# Altium schematic sheet Sheet1.SchDoc: kkkk
size A4
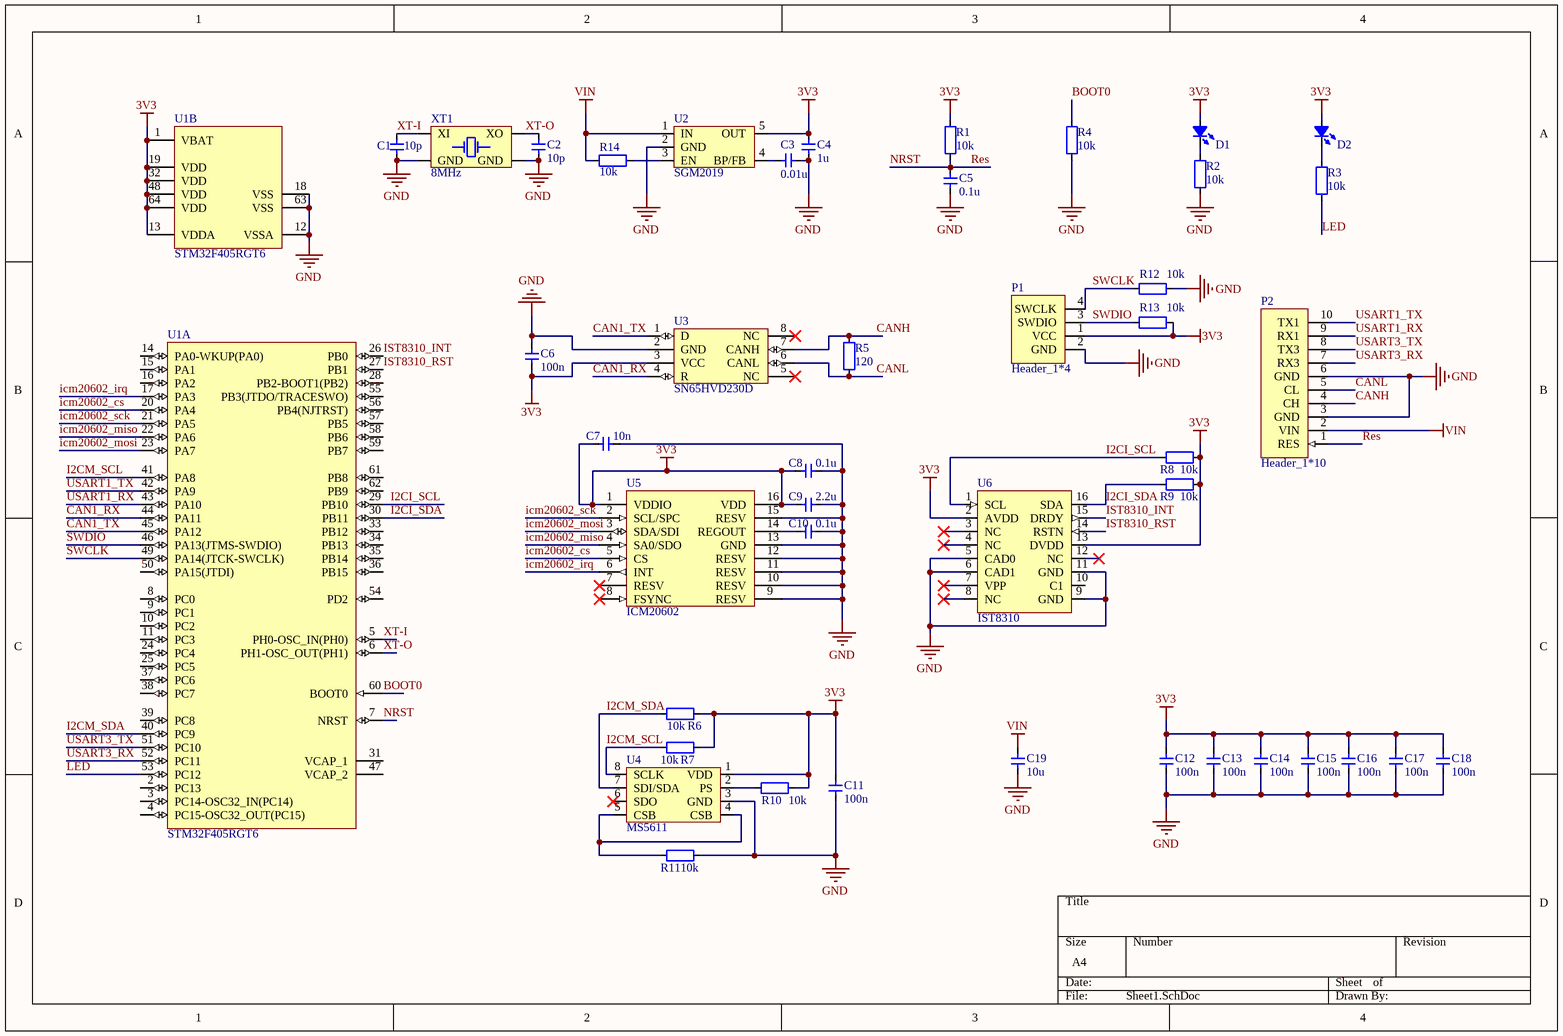
[diagram p0: Sheet1.SchDoc]

## Parts
C1  value 10p  [CAP_0603]  (hidden comment: Cap_0603)
C2  value 10p  [CAP_0603]  (hidden comment: Cap_0603)
C3  value 0.01u  [CAP_0603]  (hidden comment: Cap_0603)
C4  value 1u  [CAP_0603]  (hidden comment: Cap_0603)
C5  value 0.1u  [CAP_0603]  (hidden comment: Cap_0603)
C6  value 100n  [CAP_0603]  (hidden comment: Cap_0603)
C7  value 10n  [CAP_0603]  (hidden comment: Cap_0603)
C8  value 0.1u  [CAP_0603]  (hidden comment: Cap_0603)
C9  value 2.2u  [CAP_0603]  (hidden comment: Cap_0603)
C10  value 0.1u  [CAP_0603]  (hidden comment: Cap_0603)
C11  value 100n  [CAP_0603]  (hidden comment: Cap_0603)
C12  value 100n  [CAP_0603]  (hidden comment: Cap_0603)
C13  value 100n  [CAP_0603]  (hidden comment: Cap_0603)
C14  value 100n  [CAP_0603]  (hidden comment: Cap_0603)
C15  value 100n  [CAP_0603]  (hidden comment: Cap_0603)
C16  value 100n  [CAP_0603]  (hidden comment: Cap_0603)
C17  value 100n  [CAP_0603]  (hidden comment: Cap_0603)
C18  value 100n  [CAP_0603]  (hidden comment: Cap_0603)
C19  value 10u  [CAP_0805]  (hidden comment: Cap_0805)
D1  LED_0603  [LED_0603]  (value not drawn)
D2  LED_0603  [LED_0603]  (value not drawn)
P1  Header_1*4  [HDR1*4]
P2  Header_1*10  [HDR1*10]
R1  value 10k  [RES_0603]  (hidden comment: Res_0603)
R2  value 10k  [RES_0603]  (hidden comment: Res_0603)
R3  value 10k  [RES_0603]  (hidden comment: Res_0603)
R4  value 10k  [RES_0603]  (hidden comment: Res_0603)
R5  value 120  [RES_0603]  (hidden comment: Res_0603)
R6  value 10k  [RES_0603]  (hidden comment: Res_0603)
R7  value 10k  [RES_0603]  (hidden comment: Res_0603)
R8  value 10k  [RES_0603]  (hidden comment: Res_0603)
R9  value 10k  [RES_0603]  (hidden comment: Res_0603)
R10  value 10k  [RES_0603]  (hidden comment: Res_0603)
R11  value 10k  [RES_0603]  (hidden comment: Res_0603)
R12  value 10k  [RES_0603]  (hidden comment: Res_0603)
R13  value 10k  [RES_0603]  (hidden comment: Res_0603)
R14  value 10k  [RES_0603]  (hidden comment: Res_0603)
U1  STM32F405RGT6  [STM-LQFP64_N]  (parts A,B of 2)
U2  SGM2019  [SGM2019]
U3  SN65HVD230D  [SN65HVD230]
U4  MS5611  [MS5611]
U5  ICM20602  [ICM20602]
U6  IST8310  [IST8310]
XT1  value 8MHz  [XT_2520_4]  (hidden comment: XTAL_2520_4P)

## Nets
3V3: C4.2 C6.1 C7.2 C8.2 C9.2 C11.2 C12.2 C13.2 C14.2 C15.2 C16.2 C17.2 C18.2 D1.1(A) D2.1(A) P1.1(VCC) R1.1 R6.2 R7.2 R8.2 R9.2 R10.2 R13.1 U1.1(VBAT) U1.13(VDDA) U1.19(VDD) U1.32(VDD) U1.48(VDD) U1.64(VDD) U2.5(OUT) U3.3(VCC) U4.1(VDD) U5.1(VDDIO) U5.16(VDD) U6.2(AVDD) U6.13(DVDD)
GND: C1.1 C2.1 C3.1 C4.1 C5.1 C6.2 C7.1 C8.1 C9.1 C10.1 C11.1 C12.1 C13.1 C14.1 C15.1 C16.1 C17.1 C18.1 C19.1 P1.2(GND) P2.3(GND) P2.6(GND) R2.2 R4.2 R11.2 R12.1 U1.12(VSSA) U1.18(VSS) U1.63(VSS) U2.2(GND) U3.2(GND) U4.3(GND) U5.9(RESV) U5.10(RESV) U5.11(RESV) U5.12(RESV) U5.13(GND) U5.15(RESV) U6.5(CAD0) U6.6(CAD1) U6.9(GND) U6.11(GND) XT1.2(GND) XT1.4(GND)
VIN: C19.2 P2.2(VIN) R14.1 U2.1(IN)
BOOT0: R4.1 U1.60(BOOT0)
CAN1_RX: U1.44(PA11) U3.4(R)
CAN1_TX: U1.45(PA12) U3.1(D)
CANH: P2.4(CH) R5.1 U3.7(CANH)
CANL: P2.5(CL) R5.2 U3.6(CANL)
I2CI_SCL: R8.1 U1.29(PB10) U6.1(SCL)
I2CI_SDA: R9.1 U1.30(PB11) U6.16(SDA)
I2CM_SCL: R7.1 U1.41(PA8) U4.8(SCLK)
I2CM_SDA: R6.1 U1.40(PC9) U4.7(SDI/SDA)
icm20602_cs: U1.20(PA4) U5.5(CS)
icm20602_irq: U1.17(PA3) U5.6(INT)
icm20602_miso: U1.22(PA6) U5.4(SA0/SDO)
icm20602_mosi: U1.23(PA7) U5.3(SDA/SDI)
icm20602_sck: U1.21(PA5) U5.2(SCL/SPC)
IST8310_INT: U1.26(PB0) U6.15(DRDY)
IST8310_RST: U1.27(PB1) U6.14(RSTN)
LED: R3.2 U1.53(PC12)
NRST: C5.2 P2.1(RES) R1.2 U1.7(NRST)  [also labelled Res]
SWCLK: P1.4(SWCLK) R12.2 U1.49(PA14(JTCK-SWCLK))
SWDIO: P1.3(SWDIO) R13.2 U1.46(PA13(JTMS-SWDIO))
USART1_RX: P2.9(RX1) U1.43(PA10)
USART1_TX: P2.10(TX1) U1.42(PA9)
USART3_RX: P2.7(RX3) U1.52(PC11)
USART3_TX: P2.8(TX3) U1.51(PC10)
XT-I: C1.2 U1.5(PH0-OSC_IN(PH0)) XT1.1(XI)
XT-O: C2.2 U1.6(PH1-OSC_OUT(PH1)) XT1.3(XO)
NetC3_2: C3.2 U2.4(BP/FB)
NetC10_2: C10.2 U5.14(REGOUT)
NetD1_2: D1.2(K) R2.1
NetD2_2: D2.2(K) R3.1
NetR10_1: R10.1 U4.2(PS)
NetR11_1: R11.1 U4.4(CSB) U4.5(CSB)
NetR14_2: R14.2 U2.3(EN)

Not connected (* = marked no-connect by the designer): U1 2(PC13) 3(PC14-OSC32_IN(PC14)) 4(PC15-OSC32_OUT(PC15)) 8(PC0) 9(PC1) 10(PC2) 11(PC3) 14(PA0-WKUP(PA0)) 15(PA1) 16(PA2) 24(PC4) 25(PC5) 28(PB2-BOOT1(PB2)) 31(VCAP_1) 33(PB12) 34(PB13) 35(PB14) 36(PB15) 37(PC6) 38(PC7) 39(PC8) 47(VCAP_2) 50(PA15(JTDI)) 54(PD2) 55(PB3(JTDO/TRACESWO)) 56(PB4(NJTRST)) 57(PB5) 58(PB6) 59(PB7) 61(PB8) 62(PB9); U3 5(NC)* 8(NC)*; U4 6(SDO)*; U5 7(RESV)* 8(FSYNC)*; U6 3(NC)* 4(NC)* 7(VPP)* 8(NC)* 10(C1) 12(NC)*

## Library data of the parts
C1-C18 = Cap_0603: Capacitor
C19 = Cap_0805: Capacitor
D1 D2 = LED_0603: LED
R1-R14 = Res_0603: Resistor
U1 = STM32F405RGT6: ARM Cortex-M4 32-bit MCU+FPU, 210 DMIPS, 1024 kB Flash, 192 kB Internal RAM, 51 I/Os, 64-pin LQFP, -40 to 85 degC, Tray; Manufacturer: STMicroelectronics; D/A Converter: 2x12-bit; FLASH Size (Prog) (kB): 1024; I/Os (High Current): 51; Internal RAM Size (kB): 192; Operating Frequency(F) (Processor speed) (MHz): 168; Supply Voltage(Vcc) max (V): 3.6; Supply Voltage(Vcc) min (V): 1.8; DatasheetVersion: Rev. 4; PackageVersion: Rev. 4, 06/2013; PackageReference: LQFP64; PackageDescription: 64-Pin Low Profile Quad Flat Package, 10 x 10 mm Body, 0.5 mm Pitch; Supplier 1: Digi-Key; Supplier Part Number 1: 497-11767-ND; Supplier 2: Farnell; Supplier Part Number 2: 2064363; Supplier 3: Newark; Supplier Part Number 3: 73T2329; Supplier 4: Mouser; Supplier Part Number 4: 511-STM32F405RGT6; Core: ARM Cortex-M4; Packing: Tray; Mounting Technology: Surface Mount; PartNumber: STM32F405RGT6; ComponentLink1Description: Manufacturer URL; ComponentLink1URL: http://www.st.com/web/en/home.html; ComponentLink2Description: Datasheet; ComponentLink2URL: http://www.st.com/st-web-ui/static/active/en/resource/technical/document/datasheet/DM00037051.pdf; ComponentLink3Description: Package Specification; ComponentLink3URL: http://www.st.com/st-web-ui/static/active/en/resource/technical/document/datasheet/DM00037051.pdf
XT1 = XTAL_2520_4P: Crystal Oscillator